# Altium schematic sheet Sheet3.SchDoc
size A; SheetNumber: 1; SheetTotal: 2
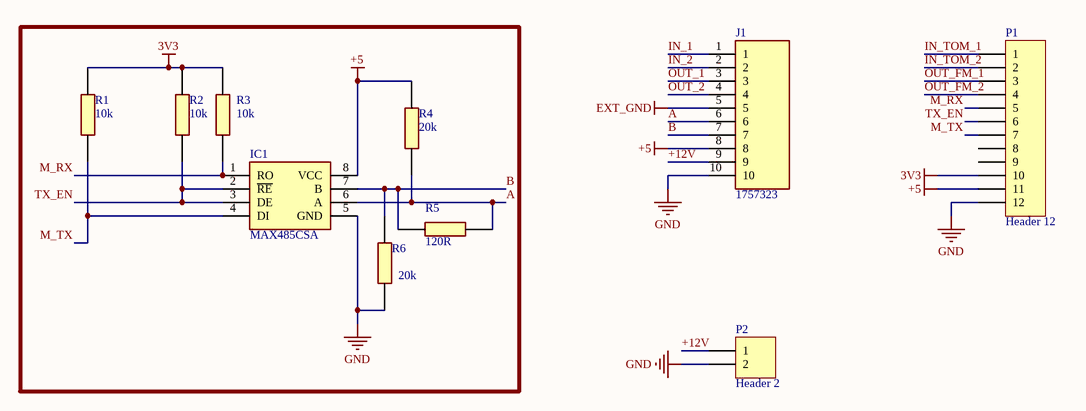
[diagram p0: Sheet3.SchDoc]

## Parts
IC1  MAX485CSA  [SOIC127P600X175-8N]
J1  1757323  [1757323]
P1  Header 12  [HDR1X12]
P2  Header 2  [HDR1X2]
R1  10k  [RESC2012X60N]
R2  10k  [RESC2012X60N]
R3  10k  [RESC2012X60N]
R4  20k  [RESC2012X60N]
R5  120R  [RESC2012X60N]
R6  20k  [RESC2012X60N]

## Nets
3V3: P1.10 R1.2 R2.2 R3.2
+5: IC1.8(VCC) J1.8 P1.11 R4.2
EXT_GND: J1.5
GND: IC1.5(GND) J1.10 P1.12 P2.2 R6.1
+12V: J1.9 P2.1
A: IC1.6(A) J1.6 R4.1 R5.2
B: IC1.7(B) J1.7 R5.1 R6.2
IN_1: J1.1
IN_2: J1.2
IN_TOM_1: P1.1
IN_TOM_2: P1.2
M_RX: IC1.1(RO) P1.5 R3.1
M_TX: IC1.4(DI) P1.7 R1.1
OUT_1: J1.3
OUT_2: J1.4
OUT_FM_1: P1.3
OUT_FM_2: P1.4
TX_EN: IC1.2(~{RE}) IC1.3(DE) P1.6 R2.1

Not connected (* = marked no-connect by the designer): P1 8 9

## Library data of the parts
IC1 = MAX485CSA: Integrated Circuit; Manufacturer_Name: Analog Devices; Datasheet Link: https://datasheets.maximintegrated.com/en/ds/MAX1487-MAX491.pdf; Height: 1.75mm; Manufacturer_Part_Number: MAX485CSA; Mouser Part Number: N/A; Mouser Price/Stock: https://www.mouser.co.uk/ProductDetail/Maxim-Integrated/MAX485CSA?qs=LHmEVA8xxfbb%2FSUlm%252BHF3Q%3D%3D
J1 = 1757323: Connector; Manufacturer_Name: Phoenix Contact; Datasheet Link: http://www.phoenixcontact.com/de/produkte/1757323/pdf; Height: 8.72mm; Manufacturer_Part_Number: 1757323; Mouser Part Number: 651-1757323; Mouser Price/Stock: https://www.mouser.co.uk/ProductDetail/Phoenix-Contact/1757323?qs=o3rrLWFGhRnEONaPlNkZ%252Bw%3D%3D; Arrow Part Number: 1757323; Arrow Price/Stock: https://www.arrow.com/en/products/1757323/phoenix-contact
P1 = Header 12: Header, 12-Pin; LatestRevisionDate: 17-Jul-2002; LatestRevisionNote: Re-released for DXP Platform.; Publisher: Altium Limited
P2 = Header 2: Header, 2-Pin; LatestRevisionDate: 17-Jul-2002; LatestRevisionNote: Re-released for DXP Platform.; Publisher: Altium Limited
R1-R3 = CR0805-FX-1002ELF: Resistor; Manufacturer_Name: Bourns; Datasheet Link: https://www.bourns.com/pdfs/chpreztr.pdf; Height: 0.6mm; Manufacturer_Part_Number: CR0805-FX-1002ELF; Mouser Part Number: 652-CR0805FX-1002ELF; Mouser Price/Stock: https://www.mouser.co.uk/ProductDetail/Bourns/CR0805-FX-1002ELF?qs=tknLyCMIRbPr%252BDD0s0nG9g%3D%3D; Arrow Part Number: CR0805-FX-1002ELF; Arrow Price/Stock: https://www.arrow.com/en/products/cr0805-fx-1002elf/bourns?region=nac
R4 R6 = CR0805-FX-2002ELF: Resistor; Manufacturer_Name: Bourns; Datasheet Link: https://www.bourns.com/pdfs/chpreztr.pdf; Height: 0.6mm; Manufacturer_Part_Number: CR0805-FX-2002ELF; Mouser Part Number: 652-CR0805FX-2002ELF; Mouser Price/Stock: https://www.mouser.co.uk/ProductDetail/Bourns/CR0805-FX-2002ELF?qs=mEbcl8R%252Bl%252Bv8rqM1zQjjRA%3D%3D; Arrow Part Number: CR0805-FX-2002ELF; Arrow Price/Stock: https://www.arrow.com/en/products/cr0805-fx-2002elf/bourns?region=nac
R5 = CR0805-JW-121ELF: Resistor; Manufacturer_Name: Bourns; Datasheet Link: https://www.bourns.com/pdfs/chpreztr.pdf; Height: 0.6mm; Manufacturer_Part_Number: CR0805-JW-121ELF; Mouser Part Number: 652-CR0805JW-121ELF; Mouser Price/Stock: https://www.mouser.co.uk/ProductDetail/Bourns/CR0805-JW-121ELF?qs=wL7NMIHXUPnmcuStpLOKew%3D%3D; Arrow Part Number: CR0805-JW-121ELF; Arrow Price/Stock: https://www.arrow.com/en/products/cr0805-jw-121elf/bourns?region=nac